# Altium schematic sheet source_B.SchDoc
size 381 x 241 mm; SheetNumber: 5; SheetTotal: 6
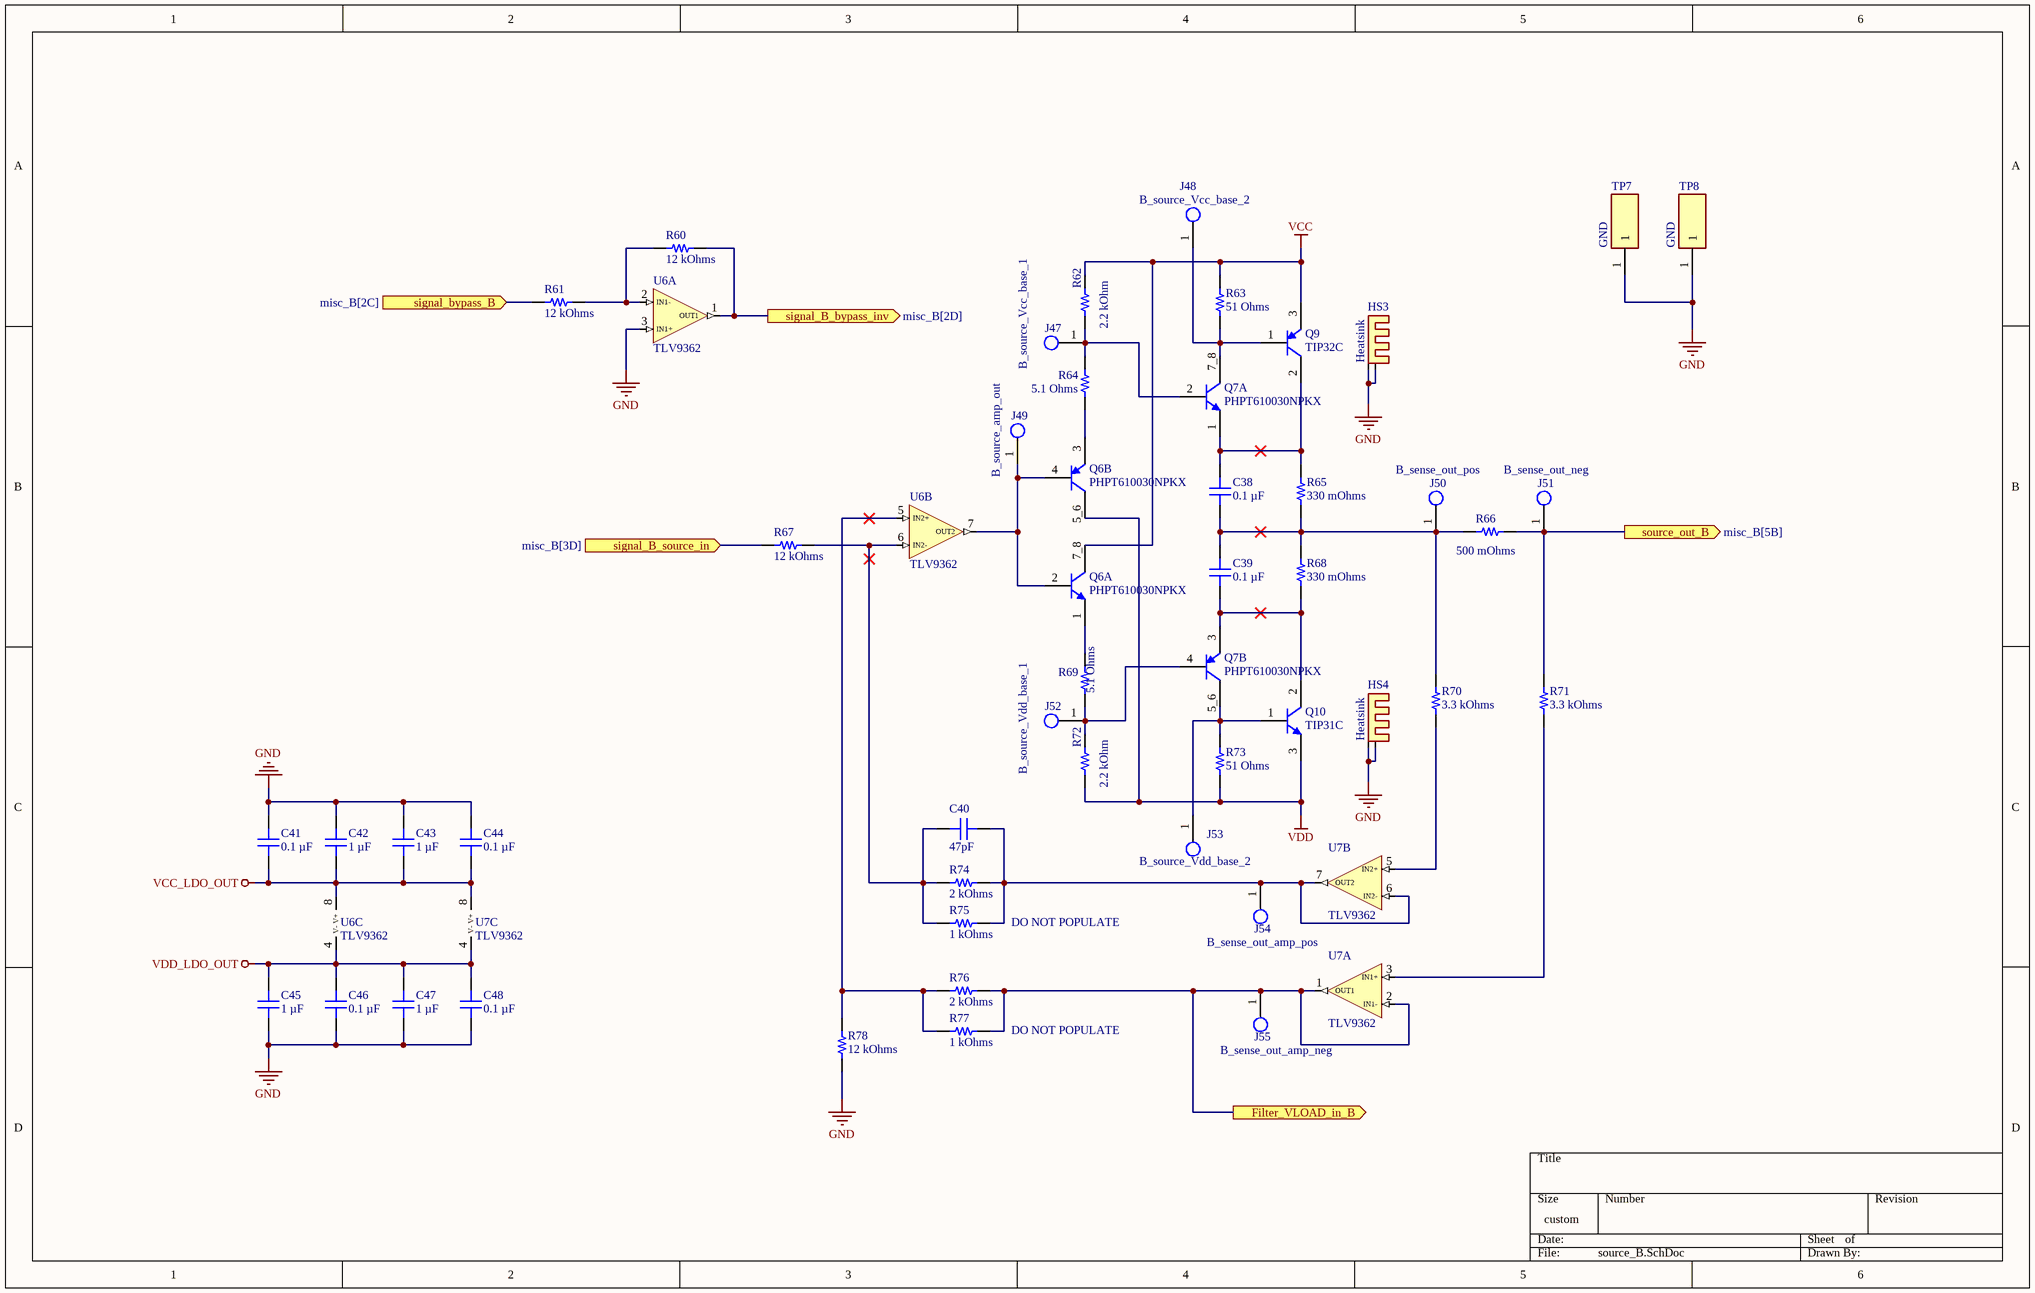
[diagram p0: source_B.SchDoc]

## Parts
C38  0.1 µF  [CAP 1206_3216 - 0.8MM]
C39  0.1 µF  [CAP 1206_3216 - 0.8MM]
C40  47pF  [CAP 1206_3216 - 1.8MM]
C41  0.1 µF  [CAP 1206_3216 - 0.8MM]
C42  1 µF  [CAP 1206_3216 - 0.8MM]
C43  1 µF  [CAP 1206_3216 - 0.8MM]
C44  0.1 µF  [CAP 1206_3216 - 0.8MM]
C45  1 µF  [CAP 1206_3216 - 0.8MM]
C46  0.1 µF  [CAP 1206_3216 - 0.8MM]
C47  1 µF  [CAP 1206_3216 - 0.8MM]
C48  0.1 µF  [CAP 1206_3216 - 0.8MM]
HS3  Heatsink  [593002B03400G]
HS4  Heatsink  [593002B03400G]
J47  B_source_Vcc_base_1  [FP-5001-MFG]
J48  B_source_Vcc_base_2  [FP-5001-MFG]
J49  B_source_amp_out  [FP-5001-MFG]
J50  B_sense_out_pos  [FP-5001-MFG]
J51  B_sense_out_neg  [FP-5001-MFG]
J52  B_source_Vdd_base_1  [FP-5001-MFG]
J53  B_source_Vdd_base_2  [FP-5001-MFG]
J54  B_sense_out_amp_pos  [FP-5001-MFG]
J55  B_sense_out_amp_neg  [FP-5001-MFG]
Q6  PHPT610030NPKX  [TRANS_BUK9K18-40E,115]  (parts A,B of 2)
Q7  PHPT610030NPKX  [TRANS_BUK9K18-40E,115]  (parts A,B of 2)
Q9  TIP32C  [ONSC-TO-220-3-221A-09]
Q10  TIP31C  [ONSC-TO-220-3-221A-09]
R60  12 kOhms  [RES 1206_3216]
R61  12 kOhms  [RES 1206_3216]
R62  2.2 kOhm  [RESC3116X65N]
R63  51 Ohms  [RES 1206_3216]
R64  5.1 Ohms  [RES 1206_3216]
R65  330 mOhms  [STACKPOLE CSR2512]
R66  500 mOhms  [STACKPOLE CSR2512]
R67  12 kOhms  [RES 1206_3216]
R68  330 mOhms  [STACKPOLE CSR2512]
R69  5.1 Ohms  [RES 1206_3216]
R70  3.3 kOhms  [YAGEO RES 1206_3216]
R71  3.3 kOhms  [YAGEO RES 1206_3216]
R72  2.2 kOhm  [RESC3116X65N]
R73  51 Ohms  [RES 1206_3216]
R74  2 kOhms  [RES 1206_3216]
R75  1 kOhms  [RES 1206_3216]
R76  2 kOhms  [RES 1206_3216]
R77  1 kOhms  [RES 1206_3216]
R78  12 kOhms  [RES 1206_3216]
TP7  GND  [S175146R]
TP8  GND  [S175146R]
U6  TLV9362  [SOIC8-127P600X175-8N]  (parts A,B,C of 3)
U7  TLV9362  [SOIC8-127P600X175-8N]  (parts A,B,C of 3)

## Ports
Filter_VLOAD_in_B (out), signal_B_bypass_inv (out, see misc_B[2D]), signal_B_source_in (in, see misc_B[3D]), signal_bypass_B (in, see misc_B[2C]), source_out_B (out, see misc_B[5B])

## Nets
GND: C41.1 C42.1 C43.2 C44.2 C45.2 C46.2 C47.2 C48.2 HS3.1 HS3.2 HS4.1 HS4.2 R78.1 TP7.1 TP8.1 U6.3(IN1+)
VCC: Q6.7_8(C1) Q9.3(E) R62.2 R63.2
VCC_LDO_OUT: C41.2 C42.2 C43.1 C44.1 U6.8(V+) U7.8(V+)
VDD: Q6.5_6(C2) Q10.3(E) R72.1 R73.1
VDD_LDO_OUT: C45.1 C46.1 C47.1 C48.1 U6.4(V-) U7.4(V-)
Filter_VLOAD_in_B: J55.1 R76.2 R77.2 U7.1(OUT1) U7.2(IN1-) ; port Filter_VLOAD_in_B
signal_B_bypass_inv: R60.2 U6.1(OUT1) ; port signal_B_bypass_inv
signal_B_source_in: R67.2 ; port signal_B_source_in
signal_bypass_B: R61.2 ; port signal_bypass_B
source_out_B: J51.1 R66.1 R71.1 ; port source_out_B
NetC38_1: C38.1 C39.2 J50.1 R65.1 R66.2 R68.2 R70.1
NetC38_2: C38.2 Q7.1(E1) Q9.2(C) R65.2
NetC39_1: C39.1 Q7.3(E2) Q10.2(C) R68.1
NetC40_1: C40.1 R67.1 R74.1 R75.1 U6.6(IN2-)
NetC40_2: C40.2 J54.1 R74.2 R75.2 U7.6(IN2-) U7.7(OUT2)
NetJ47_1: J47.1 Q7.2(B1) R62.1 R64.2
NetJ48_1: J48.1 Q7.7_8(C1) Q9.1(B) R63.1
NetJ49_1: J49.1 Q6.2(B1) Q6.4(B2) U6.7(OUT2)
NetJ52_1: J52.1 Q7.4(B2) R69.1 R72.2
NetJ53_1: J53.1 Q7.5_6(C2) Q10.1(B) R73.2
NetQ6_1: Q6.1(E1) R69.2
NetQ6_3: Q6.3(E2) R64.1
NetR60_1: R60.1 R61.1 U6.2(IN1-)
NetR70_2: R70.2 U7.5(IN2+)
NetR71_2: R71.2 U7.3(IN1+)
NetR76_1: R76.1 R77.1 R78.2 U6.5(IN2+)

## Notes on the sheet
- DO NOT POPULATE

## Library data of the parts
C38 C39 C41 C44 C46 C48 = 885012208087: CAP CER 0.1UF 50V X7R 1206; manufacturer: Würth Elektronik; Tolerance: ±10%; Part Number: 885012208087; Capacitance: 0.1 µF; Applications: General Purpose; componentlink1description: Datasheet; componentlink1url: https://katalog.we-online.de/pbs/datasheet/885012208087.pdf; componentlink2description: DigiKey Link; componentlink2url: https://www.digikey.com/en/products/detail/würth-elektronik/885012208087/5453982; Device Package: 1206 (3216 Metric); lastupdated: 6/4/2024 19:10:27; Lifecycle Status: Active; Minimum Order: 1; Mounting Type: Surface Mount, MLCC; Operating Temperature: -55°C ~ 125°C; Package / Case: 1206 (3216 Metric); packaging: TapeAndReel; partid: 20879; Part Status: Active; price: 0.06; series: WCAP-CSGP; Size / Dimension: 0.126" L x 0.063" W (3.20mm x 1.60mm); Supplier 1: DigiKey; Supplier Part Number 1: 732-8127-1-ND; Temperature Coefficient: X7R; Thickness (Max): 0.035" (0.90mm); value: 0.1 µF; Voltage - Rated: 50V
C40 = 1206AA470KAT1A: CAP CER 47PF 1KV C0G/NP0 1206; manufacturer: AVX Corporation; Temperature Coefficient: C0G, NP0; Tolerance: ±10%; Voltage - Rated: 1000V (1kV); Part Number: 1206AA470KAT1A; Capacitance: 47pF; Applications: General Purpose; componentlink1description: Datasheet; componentlink1url: http://datasheets.avx.com/AVX-HV_MLCC.pdf; componentlink2description: DigiKey Link; componentlink2url: http://digikey.com/product-detail/en/avx-corporation/1206AA470KAT1A/478-2949-1-ND/808148; Device Package: 1206 (3216 Metric); Features: High Voltage; lastupdated: 9/2/2020 01:05:31; Lifecycle Status: Active; Minimum Order: 1; Mounting Type: Surface Mount, MLCC; Operating Temperature: -55°C ~ 125°C; Package / Case: 1206 (3216 Metric); packaging: TapeAndReel; partid: 21825; Part Status: Active; price: 0.11; series: -; Size / Dimension: 0.130" L x 0.063" W (3.30mm x 1.60mm); Supplier 1: DigiKey; Supplier Part Number 1: 478-2949-1-ND; Thickness (Max): 0.071" (1.80mm); value: 47pF
C42 C43 C45 C47 = 885012208093: CAP CER 1UF 50V X7R 1206; manufacturer: Würth Elektronik; Tolerance: ±10%; Part Number: 885012208093; Capacitance: 1 µF; Applications: General Purpose; componentlink1description: Datasheet; componentlink1url: https://katalog.we-online.de/pbs/datasheet/885012208093.pdf; componentlink2description: DigiKey Link; componentlink2url: https://www.digikey.com/en/products/detail/würth-elektronik/885012208093/5453432; Device Package: 1206 (3216 Metric); lastupdated: 6/4/2024 19:10:33; Lifecycle Status: Active; Minimum Order: 1; Mounting Type: Surface Mount, MLCC; Operating Temperature: -55°C ~ 125°C; Package / Case: 1206 (3216 Metric); packaging: TapeAndReel; partid: 39665; Part Status: Active; price: 0.10; series: WCAP-CSGP; Size / Dimension: 0.126" L x 0.063" W (3.20mm x 1.60mm); Supplier 1: DigiKey; Supplier Part Number 1: 732-7577-1-ND; Temperature Coefficient: X7R; Thickness (Max): 0.075" (1.90mm); value: 1 µF; Voltage - Rated: 50V
HS3 HS4 = 593002B03400G: 593002B03400G Heatsink TO220 13.4 C/W; Manufacturer_Name: Aavid Thermalloy; Datasheet Link: 3dofAavidThermalloy593002B03400G; Height: 29.97mm; Manufacturer_Part_Number: 593002B03400G; Mouser Part Number: 532-593002B03400G; Mouser Price/Stock: https://www.mouser.co.uk/ProductDetail/Aavid/593002B03400G?qs=W5RTpZXIxnNcIJ9LzCiOiQ%3D%3D; Arrow Part Number: 593002B03400G; Arrow Price/Stock: https://www.arrow.com/en/products/593002b03400g/aavid-thermalloy
J47-J55 = 5001: PC TEST POINT MINIATURE BLACK; Body Material: Bronze; Plating: Silver; Inside Diameter: 1.27mm; Hole Diameter: 1.6mm; Number of Ports: 1; Outside Diameter: 2.54mm; Insulation: Insulated; Insulation Material: Nylon; Mount: Through Hole; RoHS Compliant: Yes; Series: THM; Height: 0.3inch; Termination: Through Hole; Material: Nylon; Packaging: Bulk; Contact Material: Bronze; REACH SVHC: No SVHC; Contact Plating: Silver; Orientation: Straight; Lead Free: Lead Free; Package Quantity: 100; Length: 7.62mm; Flammability Rating: UL94 V-0; Number of Contacts: 1; Diameter: 2.54mm; Housing Color: Black; Color: Black; Supplier 1: Mouser; Supplier Part Number 1: 534-5001
Q9 = TIP32C: Complementary Silicon Plastic Power Transistor, 3-Pin TO-220, Tube; Manufacturer: On Semiconductor; fT Min (MHz): 3; Polarity: PNP; DatasheetVersion: Rev. 14; PackageVersion: Rev. AG, 09/2011; PackageReference: TO-220-3-221A-09; PackageDescription: 3-Pin Flange Mount, Vertical Straight Lead, Body 9.97 x 4.445 mm, Pitch 2.54 mm; Supplier 1: Digi-Key; Supplier Part Number 1: TIP32COS-ND; IC Continuous (A): 3; Packing: Tube; RoHS: FALSE; Mounting Technology: Through Hole; PartNumber: TIP32C; ComponentLink1Description: Manufacturer URL; ComponentLink1URL: http://www.onsemi.com/; ComponentLink2Description: Datasheet; ComponentLink2URL: http://www.onsemi.com/pub_link/Collateral/TIP31A-D.PDF; ComponentLink3Description: Package Specification; ComponentLink3URL: http://www.onsemi.com/pub_link/Collateral/221A-09.PDF
Q10 = TIP31C: Complementary Silicon Plastic Power Transistor, 3-Pin TO-220, Tube; Manufacturer: On Semiconductor; fT Min (MHz): 3; Polarity: NPN; DatasheetVersion: Rev. 14; PackageVersion: Rev. AG, 09/2011; PackageReference: TO-220-3-221A-09; PackageDescription: 3-Pin Flange Mount, Vertical Straight Lead, Body 9.97 x 4.445 mm, Pitch 2.54 mm; Supplier 1: Digi-Key; Supplier Part Number 1: TIP31COS-ND; IC Continuous (A): 3; Packing: Tube; RoHS: FALSE; Mounting Technology: Through Hole; PartNumber: TIP31C; ComponentLink1Description: Manufacturer URL; ComponentLink1URL: http://www.onsemi.com/; ComponentLink2Description: Datasheet; ComponentLink2URL: http://www.onsemi.com/pub_link/Collateral/TIP31A-D.PDF; ComponentLink3Description: Package Specification; ComponentLink3URL: http://www.onsemi.com/pub_link/Collateral/221A-09.PDF
R60 R61 R67 R78 = ERA-8AEB123V: RES SMD 12K OHM 0.1% 1/4W 1206; Manufacturer: Panasonic Electronic Components; Power (Watts): 0.25W, 1/4W; Temperature Coefficient: ±25ppm/°C; Part Number: ERA-8AEB123V; ComponentLink1Description: Datasheet; ComponentLink1URL: https://industrial.panasonic.com/cdbs/www-data/pdf/RDM0000/AOA0000C307.pdf; ComponentLink2Description: DigiKey Link; ComponentLink2URL: https://www.digikey.com/en/products/detail/panasonic-electronic-components/ERA-8AEB123V/3070775; Composition: Thin Film; Device Package: 1206 (3216 Metric); Height - Seated (Max): 0.028" (0.70mm); LastUpdated: 2/9/2024 20:53:53; Lifecycle Status: Active; Minimum Order: 1; Number of Terminations: 2; Operating Temperature: -55°C ~ 155°C; Package / Case: 1206 (3216 Metric); Packaging: TapeAndReel; PartId: 40988; Part Status: Active; Price: 0.10; Resistance: 12 kOhms; Series: ERA-8A; Size / Dimension: 0.126" L x 0.063" W (3.20mm x 1.60mm); Supplier 1: DigiKey; Supplier Part Number 1: 10-ERA-8AEB123VCT-ND; Supplier Device Package: 1206; Tolerance: ±0.1%; Value: 12 kOhms; Features: Automotive AEC-Q200; Ratings: AEC-Q200
R62 R72 = RT1206FRE072K2L: Resistor; Manufacturer_Name: YAGEO; Datasheet Link: https://www.mouser.com/datasheet/2/447/PYu_RT_1_to_0_01_RoHS_L_12-3003070.pdf; Height: 0.65mm; Manufacturer_Part_Number: RT1206FRE072K2L; Mouser Part Number: 603-RT1206FRE072K2L; Mouser Price/Stock: https://www.mouser.co.uk/ProductDetail/YAGEO/RT1206FRE072K2L?qs=yNCrj0CQcyJif6VASMbdeQ%3D%3D; Arrow Part Number: RT1206FRE072K2L; Arrow Price/Stock: https://www.arrow.com/en/products/rt1206fre072k2l/yageo?utm_currency=USD&region=nac
R63 R73 = ERJ-8GEYJ510V: RES SMD 51 OHM 5% 1/4W 1206; Manufacturer: Panasonic Electronic Components; Power (Watts): 0.25W, 1/4W; Temperature Coefficient: ±200ppm/°C; Part Number: ERJ-8GEYJ510V; ComponentLink1Description: Datasheet; ComponentLink1URL: http://industrial.panasonic.com/www-cgi/jvcr13pz.cgi?E+PZ+3+AOA0001+ERJ8GEYJ510V+7+WW; ComponentLink2Description: DigiKey Link; ComponentLink2URL: https://www.digikey.com/en/products/detail/panasonic-electronic-components/ERJ-8GEYJ510V/11678; Composition: Thick Film; Device Package: 1206 (3216 Metric); Features: Automotive AEC-Q200; Height - Seated (Max): 0.028" (0.70mm); LastUpdated: 2/9/2024 20:54:16; Lifecycle Status: Active; Minimum Order: 1; Number of Terminations: 2; Operating Temperature: -55°C ~ 155°C; Package / Case: 1206 (3216 Metric); Packaging: TapeAndReel; PartId: 34147; Part Status: Active; Price: 0.02; Ratings: AEC-Q200; Resistance: 51 Ohms; Series: ERJ-8G; Size / Dimension: 0.126" L x 0.063" W (3.20mm x 1.60mm); Supplier 1: DigiKey; Supplier Part Number 1: P51ECT-ND; Supplier Device Package: 1206; Tolerance: ±5%; Value: 51 Ohms
R64 R69 = ERJ-8GEYJ5R1V: RES SMD 5.1 OHM 5% 1/4W 1206; Manufacturer: Panasonic Electronic Components; Power (Watts): 0.25W, 1/4W; Temperature Coefficient: -100/ +600ppm/°C; Part Number: ERJ-8GEYJ5R1V; ComponentLink1Description: Datasheet; ComponentLink1URL: http://industrial.panasonic.com/www-cgi/jvcr13pz.cgi?E+PZ+3+AOA0001+ERJ8GEYJ5R1V+7+WW; ComponentLink2Description: DigiKey Link; ComponentLink2URL: https://www.digikey.com/en/products/detail/panasonic-electronic-components/ERJ-8GEYJ5R1V/282211; Composition: Thick Film; Device Package: 1206 (3216 Metric); Features: Automotive AEC-Q200; Height - Seated (Max): 0.028" (0.70mm); LastUpdated: 2/9/2024 20:54:09; Lifecycle Status: Active; Minimum Order: 1; Number of Terminations: 2; Operating Temperature: -55°C ~ 155°C; Package / Case: 1206 (3216 Metric); Packaging: TapeAndReel; PartId: 36042; Part Status: Active; Price: 0.02; Ratings: AEC-Q200; Resistance: 5.1 Ohms; Series: ERJ-8G; Size / Dimension: 0.126" L x 0.063" W (3.20mm x 1.60mm); Supplier 1: DigiKey; Supplier Part Number 1: P5.1ECT-ND; Supplier Device Package: 1206; Tolerance: ±5%; Value: 5.1 Ohms
R65 R68 = CSRN2512FKR330: RES 0.33 OHM 1% 2W 2512; Manufacturer: Stackpole Electronics Inc; Temperature Coefficient: ±200ppm/°C; Part Number: CSRN2512FKR330; Package / Case: 2512 (6432 Metric); ComponentLink1Description: Datasheet; ComponentLink1URL: https://www.seielect.com/catalog/sei-csr_csrn.pdf; ComponentLink2Description: DigiKey Link; ComponentLink2URL: https://www.digikey.com/en/products/detail/stackpole-electronics-inc/CSRN2512FKR330/1742756; Composition: Thick Film; Device Package: 2512 (6432 Metric); Features: Current Sense; Height - Seated (Max): 0.028" (0.70mm); LastUpdated: 2/17/2022 18:43:57; Lifecycle Status: Active; Minimum Order: 1; Number of Terminations: 2; Operating Temperature: -55°C ~ 155°C; Packaging: TapeAndReel; PartId: 1770; Part Status: Active; Power (Watts): 2W; Price: 0.12; Resistance: 330 mOhms; Series: CSRN; Size / Dimension: 0.250" L x 0.124" W (6.35mm x 3.15mm); Supplier 1: DigiKey; Supplier Part Number 1: CSRN2512FKR330CT-ND; Supplier Device Package: 2512; Tolerance: ±1%; Value: 330 mOhms
R66 = CSRN2512FKR500: RES 0.5 OHM 1% 2W 2512; Manufacturer: Stackpole Electronics Inc; Temperature Coefficient: ±200ppm/°C; Part Number: CSRN2512FKR500; Package / Case: 2512 (6432 Metric); ComponentLink1Description: Datasheet; ComponentLink1URL: https://www.seielect.com/catalog/sei-csr_csrn.pdf; ComponentLink2Description: DigiKey Link; ComponentLink2URL: https://www.digikey.com/en/products/detail/stackpole-electronics-inc/CSRN2512FKR500/1742768; Composition: Thick Film; Device Package: 2512 (6432 Metric); Features: Current Sense; Height - Seated (Max): 0.028" (0.70mm); LastUpdated: 2/17/2022 18:43:58; Lifecycle Status: Active; Minimum Order: 1; Number of Terminations: 2; Operating Temperature: -55°C ~ 155°C; Packaging: TapeAndReel; PartId: 1683; Part Status: Active; Power (Watts): 2W; Price: 0.07; Resistance: 500 mOhms; Series: CSRN; Size / Dimension: 0.250" L x 0.124" W (6.35mm x 3.15mm); Supplier 1: DigiKey; Supplier Part Number 1: CSRN2512FKR500CT-ND; Supplier Device Package: 2512; Tolerance: ±1%; Value: 500 mOhms
R70 R71 = RT1206FRE073K3L: RES SMD 3.3K OHM 1% 1/4W 1206; Manufacturer: Yageo; Power (Watts): 0.25W, 1/4W; Temperature Coefficient: ±50ppm/°C; Part Number: RT1206FRE073K3L; ComponentLink1Description: Datasheet; ComponentLink1URL: https://www.yageo.com/upload/media/product/productsearch/datasheet/rchip/PYu-RT_1-to-0.01_RoHS_L_12.pdf; ComponentLink2Description: DigiKey Link; ComponentLink2URL: https://www.digikey.com/en/products/detail/yageo/RT1206FRE073K3L/1083187; Composition: Thin Film; Device Package: 1206 (3216 Metric); Height - Seated (Max): 0.026" (0.65mm); LastUpdated: 7/25/2024 09:21:22; Lifecycle Status: Active; Minimum Order: 1; Number of Terminations: 2; Operating Temperature: -55°C ~ 155°C; Package / Case: 1206 (3216 Metric); Packaging: TapeAndReel; PartId: 58380; Part Status: Active; Price: 0.01; Resistance: 3.3 kOhms; Series: RT; Size / Dimension: 0.122" L x 0.063" W (3.10mm x 1.60mm); Supplier 1: DigiKey; Supplier Part Number 1: 13-RT1206FRE073K3LCT-ND; Supplier Device Package: 1206; Tolerance: ±1%; Value: 3.3 kOhms
R74 R76 = ERA-8AEB202V: RES SMD 2K OHM 0.1% 1/4W 1206; Manufacturer: Panasonic Electronic Components; Power (Watts): 0.25W, 1/4W; Temperature Coefficient: ±25ppm/°C; Part Number: ERA-8AEB202V; ComponentLink1Description: Datasheet; ComponentLink1URL: https://industrial.panasonic.com/cdbs/www-data/pdf/RDM0000/AOA0000C307.pdf; ComponentLink2Description: DigiKey Link; ComponentLink2URL: https://www.digikey.com/en/products/detail/panasonic-electronic-components/ERA-8AEB202V/3070866; Composition: Thin Film; Device Package: 1206 (3216 Metric); Features: Automotive AEC-Q200; Height - Seated (Max): 0.028" (0.70mm); LastUpdated: 2/9/2024 20:54:17; Lifecycle Status: Active; Minimum Order: 1; Number of Terminations: 2; Operating Temperature: -55°C ~ 155°C; Package / Case: 1206 (3216 Metric); Packaging: TapeAndReel; PartId: 34011; Part Status: Active; Price: 0.10; Ratings: AEC-Q200; Resistance: 2 kOhms; Series: ERA-8A; Size / Dimension: 0.126" L x 0.063" W (3.20mm x 1.60mm); Supplier 1: DigiKey; Supplier Part Number 1: P2.0KBCCT-ND; Supplier Device Package: 1206; Tolerance: ±0.1%; Value: 2 kOhms
R75 R77 = ERA-8AEB102V: RES SMD 1K OHM 0.1% 1/4W 1206; Manufacturer: Panasonic Electronic Components; Power (Watts): 0.25W, 1/4W; Temperature Coefficient: ±25ppm/°C; Part Number: ERA-8AEB102V; ComponentLink1Description: Datasheet; ComponentLink1URL: https://industrial.panasonic.com/cdbs/www-data/pdf/RDM0000/AOA0000C307.pdf; ComponentLink2Description: DigiKey Link; ComponentLink2URL: https://www.digikey.com/en/products/detail/panasonic-electronic-components/ERA-8AEB102V/3070741; Composition: Thin Film; Device Package: 1206 (3216 Metric); Features: Automotive AEC-Q200; Height - Seated (Max): 0.028" (0.70mm); LastUpdated: 2/9/2024 20:54:17; Lifecycle Status: Active; Minimum Order: 1; Number of Terminations: 2; Operating Temperature: -55°C ~ 155°C; Package / Case: 1206 (3216 Metric); Packaging: TapeAndReel; PartId: 33986; Part Status: Active; Price: 0.10; Ratings: AEC-Q200; Resistance: 1 kOhms; Series: ERA-8A; Size / Dimension: 0.126" L x 0.063" W (3.20mm x 1.60mm); Supplier 1: DigiKey; Supplier Part Number 1: P1.0KBCCT-ND; Supplier Device Package: 1206; Tolerance: ±0.1%; Value: 1 kOhms
TP7 TP8 = S1751-46R: Test Point; Manufacturer_Name: Harwin; Datasheet Link: https://cdn.harwin.com/pdfs/S1751R.pdf; Height: 2mm; Manufacturer_Part_Number: S1751-46R; Mouser Part Number: 855-S1751-46R; Mouser Price/Stock: https://www.mouser.co.uk/ProductDetail/Harwin/S1751-46R?qs=l6ZPVqNVZb71wETAKrfRig%3D%3D
U6 U7 = TLV9362: TLV936x 10-MHz, 40-V, RRO, Operational Amplifie; ComponentLink1Description: Datasheet; ComponentLink1URL: https://www.ti.com/lit/ds/symlink/tlv9362.pdf
Q6 Q7 = PHPT610030NPKX: ComponentLink1Description: Datasheet; ComponentLink1URL: https://assets.nexperia.com/documents/data-sheet/PHPT610030NPK.pdf; ComponentLink2Description: Supplier; ComponentLink2URL: https://hr.mouser.com/ProductDetail/Nexperia/PHPT610030NPKX?qs=%252BRKXB2WKlSeoXKhT5DAScw%3D%3D